# EAGLE design CAN Bus Controller - REV 1 (EAGLE 9.6.2)
DOC_NAME: CAN BUS CONTROLLER; DOC_REVISION: 1; INITIALS_DRAWN: KJD
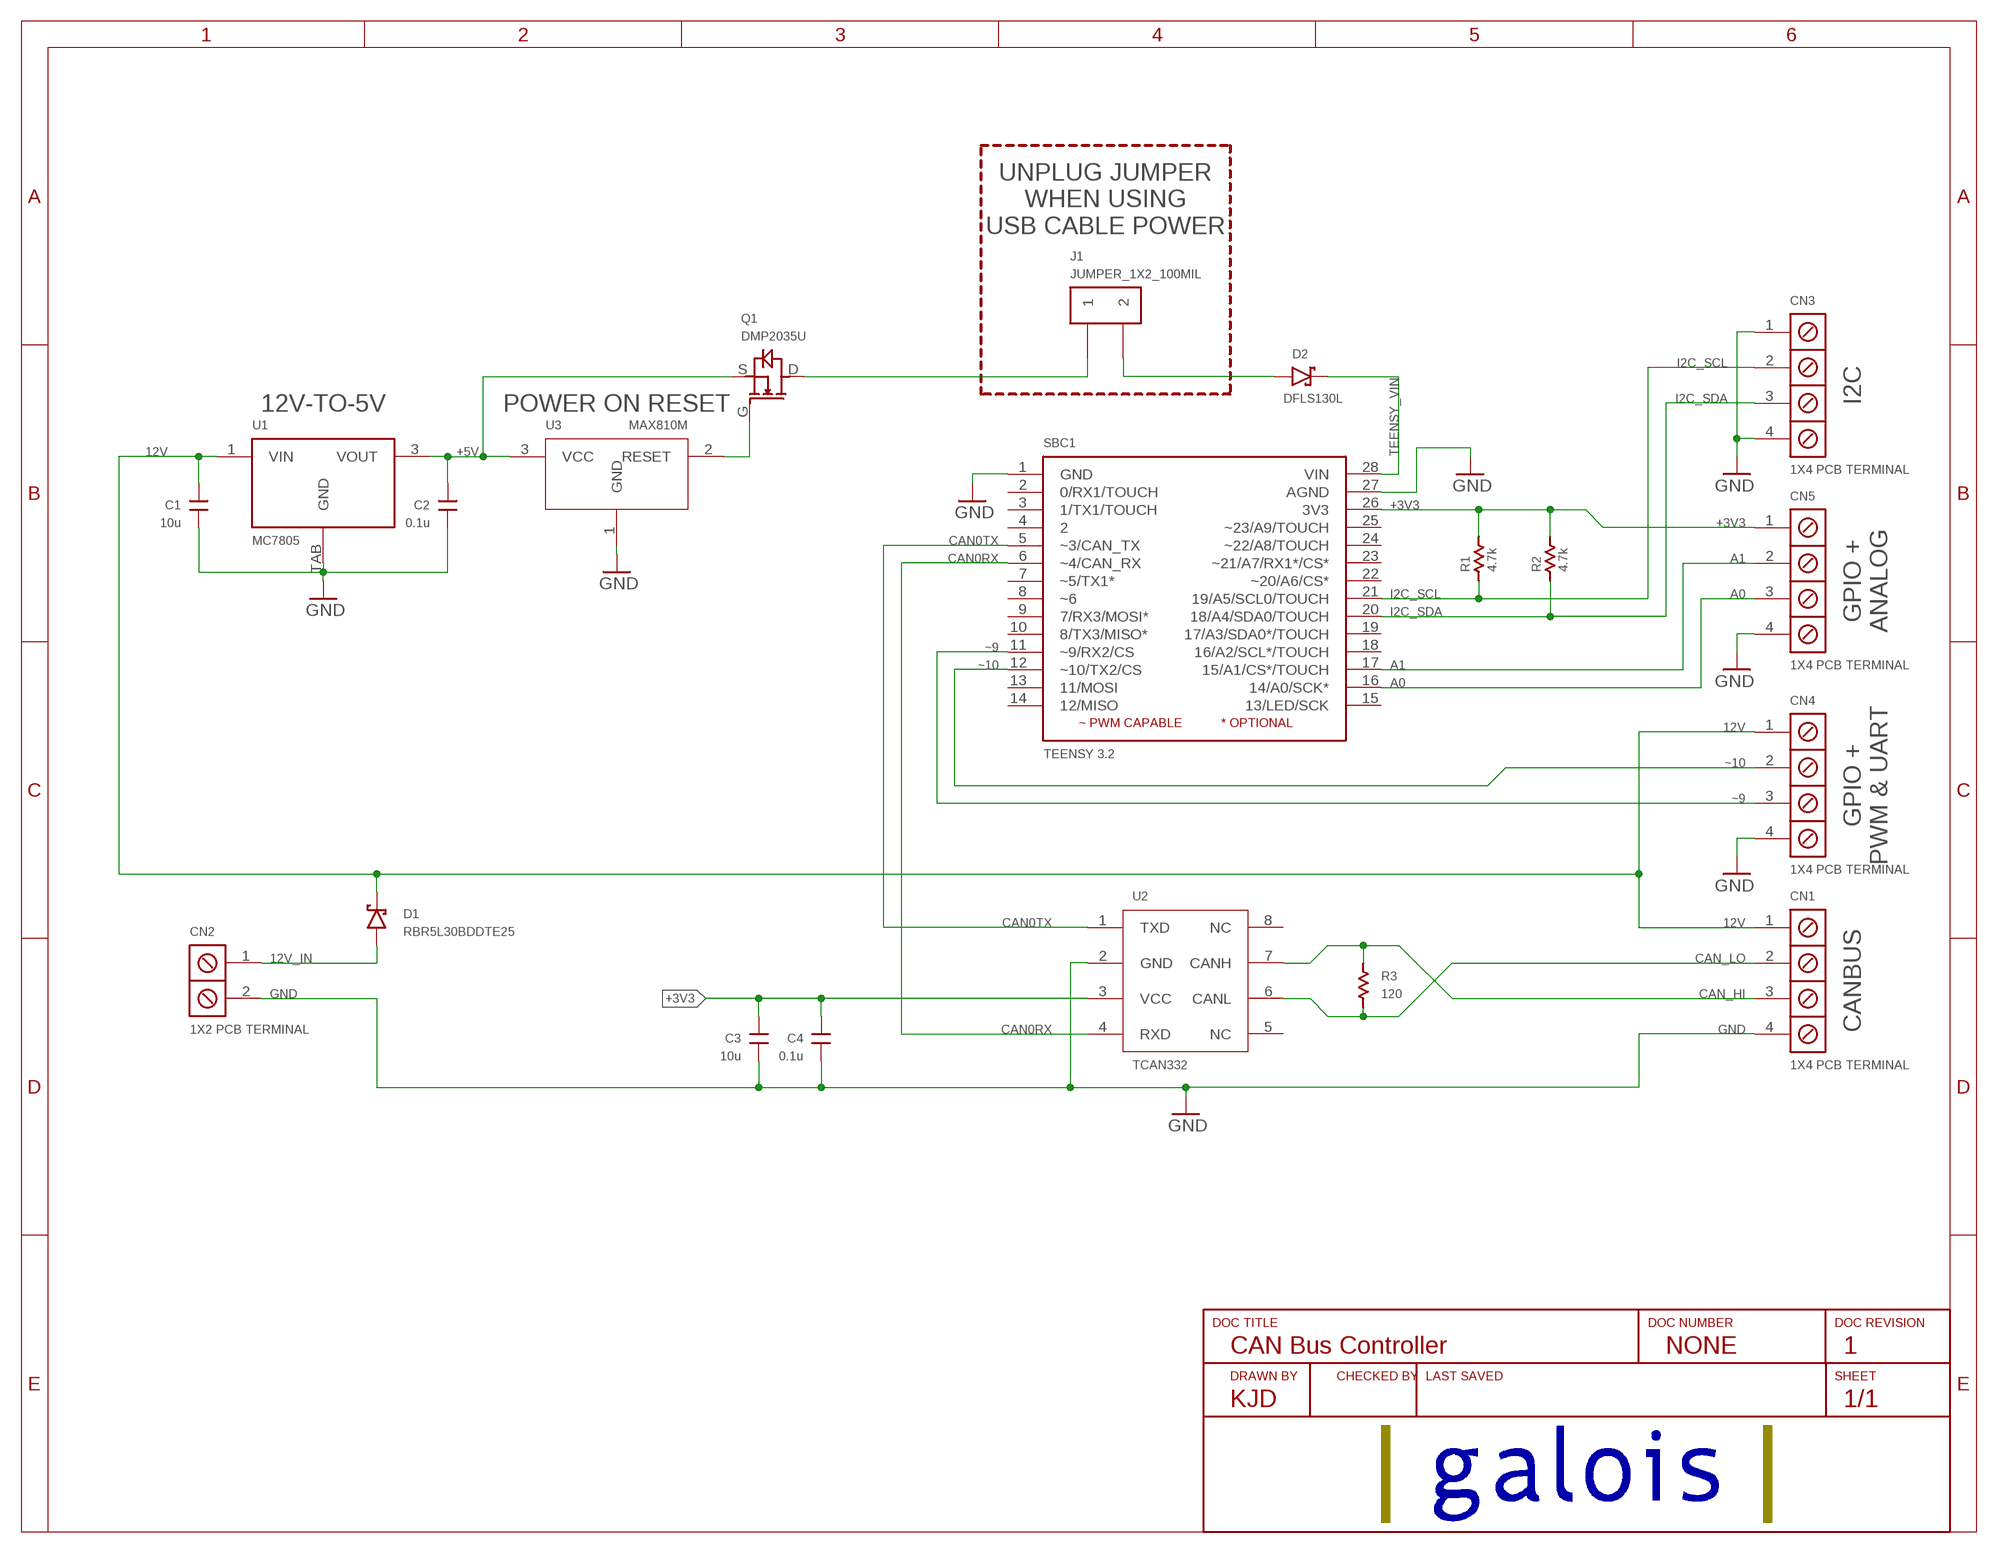
[diagram p0: schematic, sheet 1]

## Parts
C1  10u  C_SMDC1206  [EIA1206]
C2  0.1u  C_SMDC0603  [EIA0603]
C3  10u  C_SMDC1206  [EIA1206]
C4  0.1u  C_SMDC0603  [EIA0603]
CN1  1X4 PCB TERMINAL  1984633  [PCB_TERM_3.5MM_PITCH_1X4]
CN2  1X2 PCB TERMINAL  1984617  [PCB_TERM_3.5MM_PITCH_1X2]
CN3  1X4 PCB TERMINAL  1984633  [PCB_TERM_3.5MM_PITCH_1X4]
CN4  1X4 PCB TERMINAL  1984633  [PCB_TERM_3.5MM_PITCH_1X4]
CN5  1X4 PCB TERMINAL  1984633  [PCB_TERM_3.5MM_PITCH_1X4]
D1  RBR5L30BDDTE25  SCHOTTKYSMA  [SMA]
D2  DFLS130L  SCHOTTKYPOWERDI_123  [POWERDI_123]
J1  JUMPER_1X2_100MIL  1X2  [1X2_100MIL_THRU]
Q1  DMP2035U  [SOT-23-3]
R1  4.7k  R_SMDR0603  [EIA0603]
R2  4.7k  R_SMDR0603  [EIA0603]
R3  120  R_SMDR1210  [EIA1210]
SBC1  TEENSY 3.2  TEENSY3.2  [TEENSY3.2]
U1  MC7805  MC78XX  [DPAK-3]
U2  TCAN332  TCAN332_CANBUS_RXTX  [SOIC-8]
U3  MAX810M  MAX809/810  [SOT23-3]

## Nets
12V: C1.P$2 CN1.1 CN4.1 D1.C U1.1(VIN)
12V_IN: CN2.1 D1.A
+3V3: C3.P$2 C4.P$2 CN5.1 R1.P$2 R2.P$2 SBC1.26(3V3) U2.3(VCC)
+5V: C2.P$2 Q1.S U1.3(VOUT) U3.3(VCC)
A0: CN5.3 SBC1.16(14/A0/SCK*)
A1: CN5.2 SBC1.17(15/A1/CS*/TOUCH)
CAN0RX: SBC1.6(~4/CAN_RX) U2.4(RXD)
CAN0TX: SBC1.5(~3/CAN_TX) U2.1(TXD)
CAN_HI: CN1.3 R3.P$2 U2.7(CANH)
CAN_LO: CN1.2 R3.P$1 U2.6(CANL)
GND: C1.P$1 C2.P$1 C3.P$1 C4.P$1 CN1.4 CN2.2 CN3.1 CN3.4 CN4.4 CN5.4 SBC1.1(GND) SBC1.27(AGND) U1.TAB(GND) U2.2(GND) U3.1(GND)
I2C_SCL: CN3.2 R1.P$1 SBC1.21(19/A5/SCL0/TOUCH)
I2C_SDA: CN3.3 R2.P$1 SBC1.20(18/A4/SDA0/TOUCH)
N$1: J1.1 Q1.D
N$2: D2.A J1.2
N$26: Q1.G U3.2(RESET)
TEENSY_VIN: D2.C SBC1.28(VIN)
~9: CN4.3 SBC1.11(~9/RX2/CS)
~10: CN4.2 SBC1.12(~10/TX2/CS)
Unconnected: SBC1.2(0/RX1/TOUCH) SBC1.3(1/TX1/TOUCH) SBC1.4 SBC1.7(~5/TX1*) SBC1.8(~6) SBC1.9(7/RX3/MOSI*) SBC1.10(8/TX3/MISO*) SBC1.13(11/MOSI) SBC1.14(12/MISO) SBC1.15(13/LED/SCK) SBC1.18(16/A2/SCL*/TOUCH) SBC1.19(17/A3/SDA0*/TOUCH) SBC1.22(~20/A6/CS*) SBC1.23(~21/A7/RX1*/CS*) SBC1.24(~22/A8/TOUCH) SBC1.25(~23/A9/TOUCH) U2.5(NC) U2.8(NC)

## Notes on the sheet
- UNPLUG JUMPER
  WHEN USING
  USB CABLE POWER
- I2C
- 12V-TO-5V | POWER ON RESET
- GPIO +
  ANALOG
- GPIO +
  PWM & UART
- CANBUS
- CAN Bus Controller | NONE | 1
- KJD

## Library data of the parts
C1 C3 = USER_SMT_CHIP_STANDARD:C_SMD; MPN: CL31A106KBHNNNE; PACKAGE: 1206
C2 C4 = USER_SMT_CHIP_STANDARD:C_SMD; MPN: CL10B104KA8NNNC; PACKAGE: 0603
CN1 CN3-CN5 = USER_PCB_TERMINALS:1984633; MPN: 1984633
CN2 = USER_PCB_TERMINALS:1984617; MPN: 1984617
D1 = USER_DIODES:SCHOTTKY; MPN: RBR5L30BDDTE25
D2 = USER_DIODES:SCHOTTKY; MPN: DFLS130L-7
J1 = USER_CON_PINS:1X2; MPN: QPC02SXGN-RC
Q1 = USER_MOSFETS:DMP2035U; MPN: DMP2035U-7
R1 R2 = USER_SMT_CHIP_STANDARD:R_SMD; MPN: ERJ-3EKF4701V; PACKAGE: 0603
R3 = USER_SMT_CHIP_STANDARD:R_SMD; MPN: AC1210FR-07120RL
SBC1 = USER_PJRC_TEENSY:TEENSY3.2; MPN: TEENSY32_PINS
U1 = USER_PMIC:MC78XX; MPN: MC7805CDTRKG
U2 = USER_SERIAL_TRANSCEIVERS:TCAN332_CANBUS_RXTX; MPN: TCAN332DR
U3 = USER_PMIC:MAX809/810; MPN: MAX810MTRG

## Board
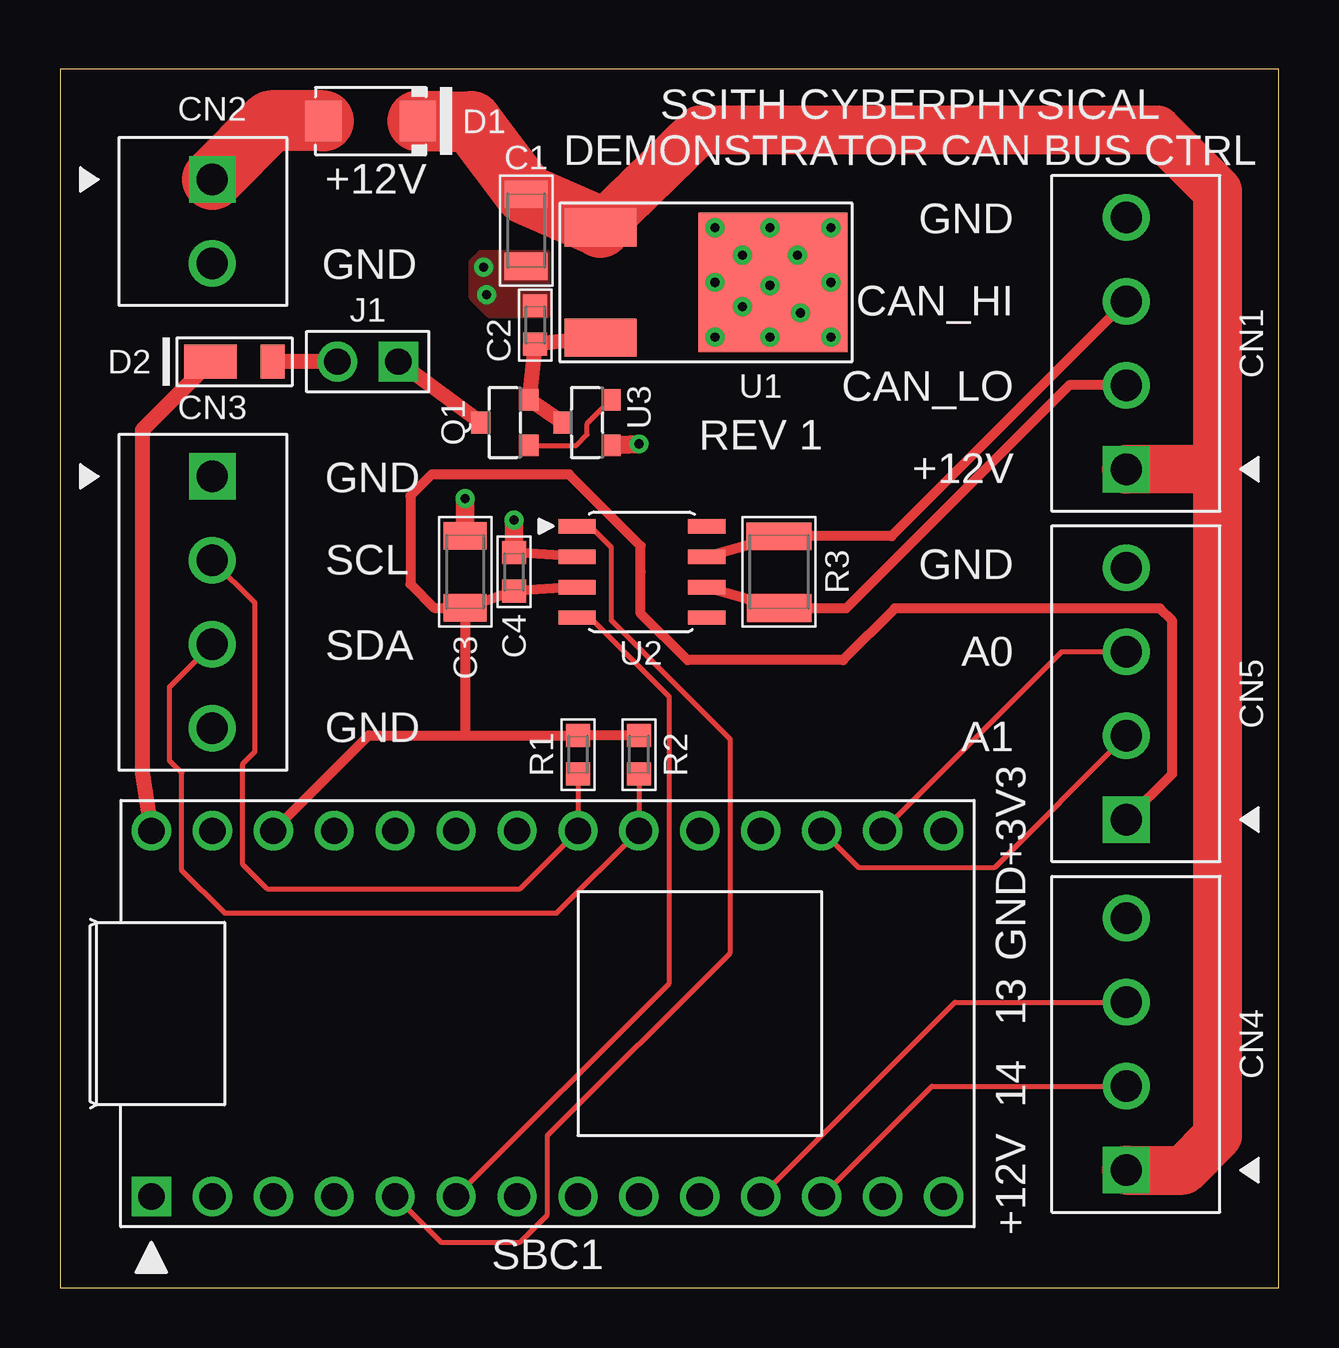
[diagram p1: board, top side]
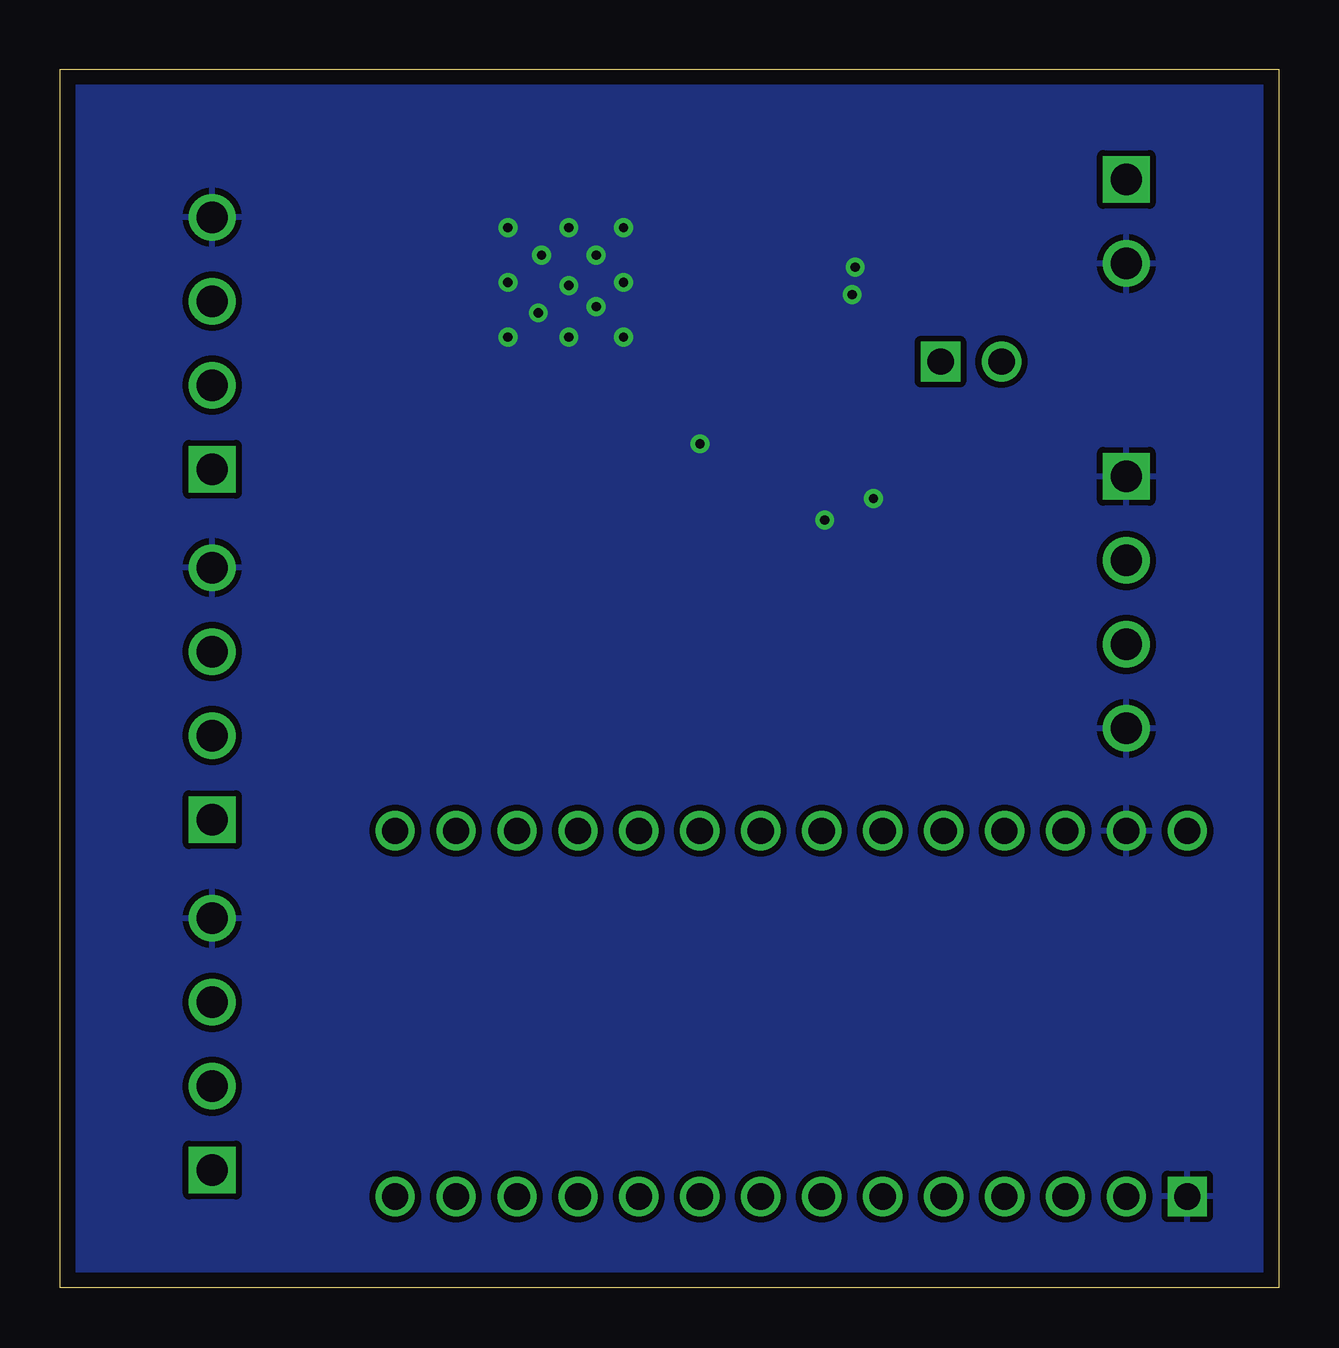
[diagram p2: board, bottom side, seen from below]

Size 50.8 x 50.8 mm. Coordinates in mm from the lower left corner, seen from the top.
Outline: 0,0 50.8,0 50.8,50.8 0,50.8 0,0
Copper layers (1*16): Top 0.035mm / dielectric 1.5mm / Bottom 0.035mm
Design rules "default *": minimum track width 6mil, minimum drill 0.35mm, track to track 6mil, track to pad 6mil, pad to pad 6mil, via to via 6mil, smd to smd 6mil, copper to edge 25mil, drill to drill 6mil, minimum pad ring 10mil, minimum via ring 8mil, stop-mask expansion 4mil, vias tented up to drill 0mil, thermal gap 10mil

### Footprints (pad centres in the part's own frame; a part is rotated, then mirrored left to right if it is on the bottom)
EIA1206 = smd 1.15 x 1.8: P$1 -1.5,0; P$2 1.5,0
EIA0603 = smd 0.95 x 1: P$1 -0.8,0; P$2 0.8,0
PCB_TERM_3.5MM_PITCH_1X4 = drill 1.3 square: 1 -5.25,0 | drill 1.3: 2 -1.75,0; 3 1.75,0; 4 5.25,0
PCB_TERM_3.5MM_PITCH_1X2 = drill 1.3 square: 1 -1.75,0 | drill 1.3: 2 1.75,0
SMA = smd 1.52 x 1.68: A -1.97,0; C 1.97,0
POWERDI_123 = smd 1 x 1.4: A 1,0 | smd 2.2 x 1.4: C -1.6,0
1X2_100MIL_THRU = drill 1.1 square: 1 0,1.27 | drill 1.1: 2 0,-1.27
SOT-23-3 = smd 0.9 x 0.8: D 0,1; G -0.95,-1; S 0.95,-1
EIA1210 = smd 1.15 x 2.7: P$1 -1.508,-0.01; P$2 1.484,0.004
TEENSY3.2 = drill 1.092 square: 1 -7.62,16.51 | drill 1.092: 2 -7.62,13.97; 3 -7.62,11.43; 4 -7.62,8.89; 5 -7.62,6.35; 6 -7.62,3.81; 7 -7.62,1.27; 8 -7.62,-1.27; 9 -7.62,-3.81; 10 -7.62,-6.35; 11 -7.62,-8.89; 12 -7.62,-11.43; 13 -7.62,-13.97; 14 -7.62,-16.51; 15 7.62,-16.51; 16 7.62,-13.97; 17 7.62,-11.43; 18 7.62,-8.89; 19 7.62,-6.35; 20 7.62,-3.81; 21 7.62,-1.27; 22 7.62,1.27; 23 7.62,3.81; 24 7.62,6.35; 25 7.62,8.89; 26 7.62,11.43; 27 7.62,13.97; 28 7.62,16.51
DPAK-3 = smd 3 x 1.6: 1 4.4,-2.3; 3 4.4,2.3 | smd 6.2 x 5.8: TAB -2.8,0
SOIC-8 = smd 1.55 x 0.6: 1 -2.7,1.905; 2 -2.7,0.635; 3 -2.7,-0.635; 4 -2.7,-1.905; 5 2.7,-1.905; 6 2.7,-0.635; 7 2.7,0.635; 8 2.7,1.905
SOT23-3 = smd 0.9 x 0.8: 1 -0.95,-1; 2 0.95,-1; 3 0,1

### Placement (x,y rotation side)
C1  19.43,44.07 90 top
C2  19.81,40.13 270 top
C3  16.89,29.84 270 top
C4  18.92,29.84 270 top
CN1  44.45,39.37 90 top
CN2  6.35,44.45 270 top
CN3  6.35,28.57 270 top
CN4  44.45,10.16 90 top
CN5  44.45,24.77 90 top
D1  12.95,48.64 0 top
D2  7.87,38.61 0 top
J1  12.83,38.61 270 top
Q1  18.54,36.07 90 top
R1  21.59,22.23 90 top
R2  24.13,22.23 90 top
R3  29.97,29.84 90 top
SBC1  20.32,11.43 90 top
U1  26.92,41.91 180 top
U2  24.26,29.84 0 top
U3  21.97,36.07 90 top

### Tracks (layer width: path | path; a pad name or v marks a point on that pad's centre or on a via)
12V
  Top 2.032: CN4.1 46.82,4.91 48.26,6.35 48.26,34.14 | 48.26,34.14 48.26,45.72 45.72,48.26 26.67,48.26 U1.1 | CN1.1 48.26,34.14
  Top 2.54: U1.1 C1.P$2 17.14,48.62 D1.C
12V_IN
  Top 2.54: D1.A 8.79,48.64 CN2.1
+3V3
  Top 0.406: SBC1.26 12.87,23.02 16.89,23.02 | 16.89,23.02 R1.P$2 R2.P$2 | U2.3 C4.P$2 C3.P$2 | C3.P$2 16.89,23.02 | CN5.1 46.35,21.42 46.35,27.81 45.85,28.32 34.8,28.32 32.64,26.16 26.16,26.16 24.21,28.12 24.21,29.84 24.21,30.92 21.22,33.91 15.49,33.91 14.61,33.02 14.61,29.34 15.6,28.34 C3.P$2
+5V
  Top 0.635: U1.3 C2.P$2 Q1.S U3.3
A0
  Top 0.203: SBC1.16 41.76,26.52 CN5.3
A1
  Top 0.203: SBC1.17 33.27,17.53 38.96,17.53 CN5.2
CAN0RX
  Top 0.203: SBC1.6 25.4,12.7 25.4,24.64 22.1,27.94 U2.4
CAN0TX
  Top 0.203: SBC1.5 15.88,1.91 19.18,1.91 20.32,3.05 20.32,6.35 27.94,13.97 27.94,22.86 22.99,27.81 22.99,30.86 22.1,31.75 U2.1
CAN_HI
  Top 0.406: U2.7 R3.P$2 34.66,31.33 CN1.3
CAN_LO
  Top 0.203: 30.73,28.32 30,28.32 R3.P$1
  Top 0.406: U2.6 R3.P$1 | CN1.2 42.06,37.62 32.77,28.32 30,28.32
GND  (via drill 0.38)
  Top 0.406: U2.2 C4.P$1 | U1.TAB v30.86,40.64
  Top 0.762: U3.1 v24.13,35.18 | C4.P$1 v18.92,32 | C3.P$1 v16.89,32.89
  other vias: 27.3,44.2 27.3,41.91 27.3,39.62 32.13,39.62 32.13,41.91 32.13,44.2 29.59,44.2 29.59,41.78 29.59,39.62 28.45,43.05 30.73,43.05 28.45,40.89 17.65,42.55 17.78,41.4
  pour Bottom (isolate 0.254): 0,50.8 0,0 50.8,0 50.8,50.8
  pour Top (isolate 0.254): 17.91,40.51 17.14,41.27 17.14,42.8 17.53,43.18 20.32,43.18 20.32,40.51
I2C_SCL
  Top 0.203: R1.P$1 SBC1.21 19.18,16.64 8.64,16.64 7.62,17.65 7.62,21.84 8.13,22.35 8.13,28.55 CN3.2
I2C_SDA
  Top 0.203: R2.P$1 SBC1.20 20.7,15.62 6.86,15.62 5.08,17.4 5.08,21.46 4.57,21.97 4.57,25.05 CN3.3
N$1
  Top 0.635: Q1.D J1.1
N$2
  Top 0.635: J1.2 D2.A
N$26
  Top 0.203: Q1.G 21.53,35.12 21.97,35.56 21.97,36.02 U3.2
TEENSY_VIN
  Top 0.635: D2.C 3.43,35.76 3.43,21.46 SBC1.28
~9
  Top 0.203: SBC1.11 37.31,11.91 CN4.3
~10
  Top 0.203: SBC1.12 36.35,8.41 CN4.2

### Text on the board
tPlace: SSITH CYBERPHYSICAL / DEMONSTRATOR CAN BUS CTRL | +12V | GND | GND | CAN_HI | CAN_LO | REV 1 | GND | +12V | SCL | GND | SDA | A0 | GND | A1 | +3V3 | GND | 13 | 14 | +12V